# Altium project PCB_Project_Rocket_Shield.PrjPcb
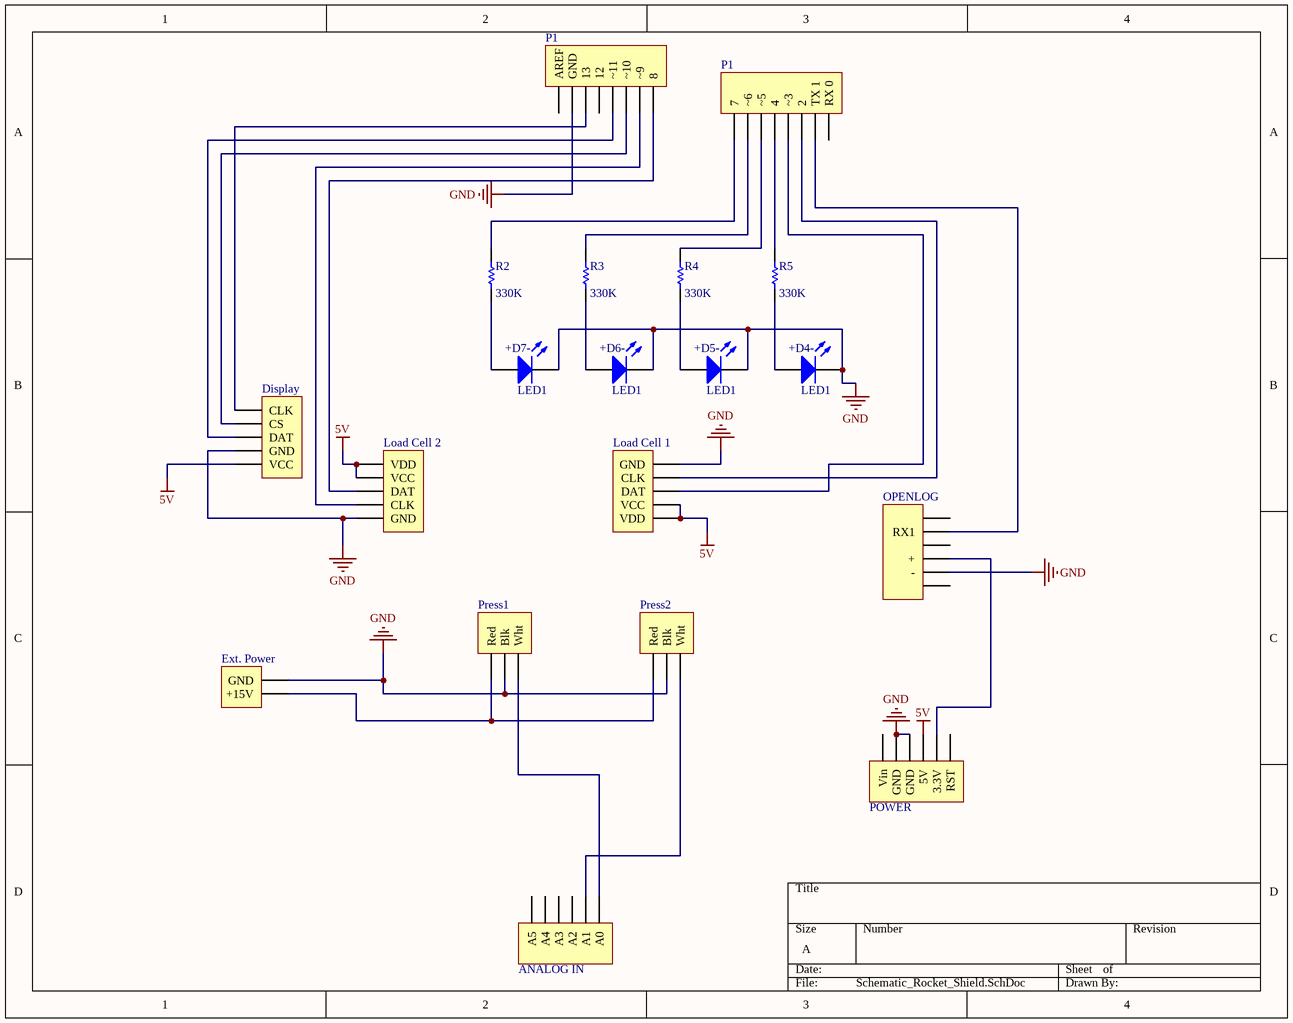
[diagram p0: Schematic_Rocket_Shield.SchDoc]
1 sheet, 19 parts. Net scope: global (net labels, ports and power ports of the same name join across sheets).
Board file: PCB_Rocket_Sheild.PcbDoc

## Sheet Schematic_Rocket_Shield.SchDoc
size A

### Parts
(Parts that share a designator on the sheet are numbered #1, #2 ... from top to bottom, then left to right.)
+D4-  LED1  [PCBComponent_1]
+D5-  LED1  [PCBComponent_1]
+D6-  LED1  [PCBComponent_1]
+D7-  LED1  [PCBComponent_1]
ANALOG_IN  Header 6  [HDR1X6]  (value not drawn)
Display  LED Display  [HDR1X5]  (value not drawn)
Ext._Power  Header 2  [HDR1X2]  (value not drawn)
Load_Cell_1  Load Cell 1  [HDR1X5]  (value not drawn)
Load_Cell_2  Load Cell 2  [HDR1X5]  (value not drawn)
OPENLOG  Header 6  [HDR1X6]  (value not drawn)
P1#1  eader 8  [HDR1X8]  (value not drawn)
P1#2  Header 8  [HDR1X8]  (value not drawn)
POWER  Header 6  [HDR1X6]  (value not drawn)
Press1  Header 3  [HDR1X3]  (value not drawn)
Press2  Header 3  [HDR1X3]  (value not drawn)
R2  value 330K  [AXIAL-0.3]
R3  value 330K  [AXIAL-0.3]
R4  value 330K  [AXIAL-0.3]
R5  value 330K  [AXIAL-0.3]

### Nets
5V: Display.5(VCC) Load_Cell_1.1(VDD) Load_Cell_1.2(VCC) Load_Cell_2.1(VDD) Load_Cell_2.2(VCC) POWER.3(5V)
GND: +D4-.2(K) +D5-.2(K) +D6-.2(K) +D7-.2(K) Display.4(GND) Ext._Power.2(GND) Load_Cell_1.5(GND) Load_Cell_2.5(GND) OPENLOG.2(-) P1#1.2(GND) POWER.4(GND) POWER.5(GND) Press1.2(Blk) Press2.2(Blk)
Net+D4-_1: +D4-.1(A) R5.1
Net+D5-_1: +D5-.1(A) R4.1
Net+D6-_1: +D6-.1(A) R3.1
Net+D7-_1: +D7-.1(A) R2.1
NetANALOG_IN_1: ANALOG_IN.1(A0) Press1.3(Wht)
NetANALOG_IN_2: ANALOG_IN.2(A1) Press2.3(Wht)
NetDisplay_1: Display.1(CLK) P1#1.3(13)
NetDisplay_2: Display.2(CS) P1#1.6(~10)
NetDisplay_3: Display.3(DAT) P1#1.5(~11)
NetExt._Power_1: Ext._Power.1(+15V) Press1.1(Red) Press2.1(Red)
NetLoad_Cell_1_3: Load_Cell_1.3(DAT) P1#2.5(~3)
NetLoad_Cell_1_4: Load_Cell_1.4(CLK) P1#2.6(2)
NetLoad_Cell_2_3: Load_Cell_2.3(DAT) P1#1.8
NetLoad_Cell_2_4: Load_Cell_2.4(CLK) P1#1.7(~9)
NetOPENLOG_3: OPENLOG.3(+) POWER.2(3.3V)
NetOPENLOG_5: OPENLOG.5(RX1) P1#2.7(TX_1)
NetP1#2_1: P1#2.1(7) R2.2
NetP1#2_2: P1#2.2(~6) R3.2
NetP1#2_3: P1#2.3(~5) R4.2
NetP1#2_4: P1#2.4 R5.2

Not connected (* = marked no-connect by the designer): ANALOG_IN 3(A2) 4(A3) 5(A4) 6(A5); OPENLOG 1 4 6; P1#1 1(AREF) 4(12); P1#2 8(RX_0); POWER 1(RST) 6(Vin)

### Library data of the parts
+D4- +D5- +D6- +D7- = LED1: Typical RED GaAs LED; Published: 8-Jun-2000; LatestRevisionDate: 08-Jul-2005; LatestRevisionNote: Mech Layer 1 removed.; PackageReference: LED-1; Publisher: Altium Limited; PackageDescription: LED; 2 Leads
ANALOG_IN OPENLOG POWER = Header 6: Header, 6-Pin; LatestRevisionDate: 17-Jul-2002; LatestRevisionNote: Re-released for DXP Platform.; Publisher: Altium Limited
Display Load_Cell_1 Load_Cell_2 = Header 5: Header, 5-Pin; LatestRevisionDate: 17-Jul-2002; LatestRevisionNote: Re-released for DXP Platform.; Publisher: Altium Limited
Ext._Power = Header 2: Header, 2-Pin; LatestRevisionDate: 17-Jul-2002; LatestRevisionNote: Re-released for DXP Platform.; Publisher: Altium Limited
P1#1 P1#2 = Header 8: Header, 8-Pin; LatestRevisionDate: 17-Jul-2002; LatestRevisionNote: Re-released for DXP Platform.; Publisher: Altium Limited
Press1 Press2 = Header 3: Header, 3-Pin; LatestRevisionDate: 17-Jul-2002; LatestRevisionNote: Re-released for DXP Platform.; Publisher: Altium Limited
R2-R5 = Res1: Resistor; Published: 8-Jun-2000; LatestRevisionDate: 17-Jul-2002; LatestRevisionNote: Re-released for DXP Platform.; PackageReference: AXIAL-0.3; Publisher: Altium Limited; PackageDescription: Axial Device, Thru-Hole; 2 Leads; 0.3 in Pin Spacing